# Altium project PS2Transiever.PrjPcb
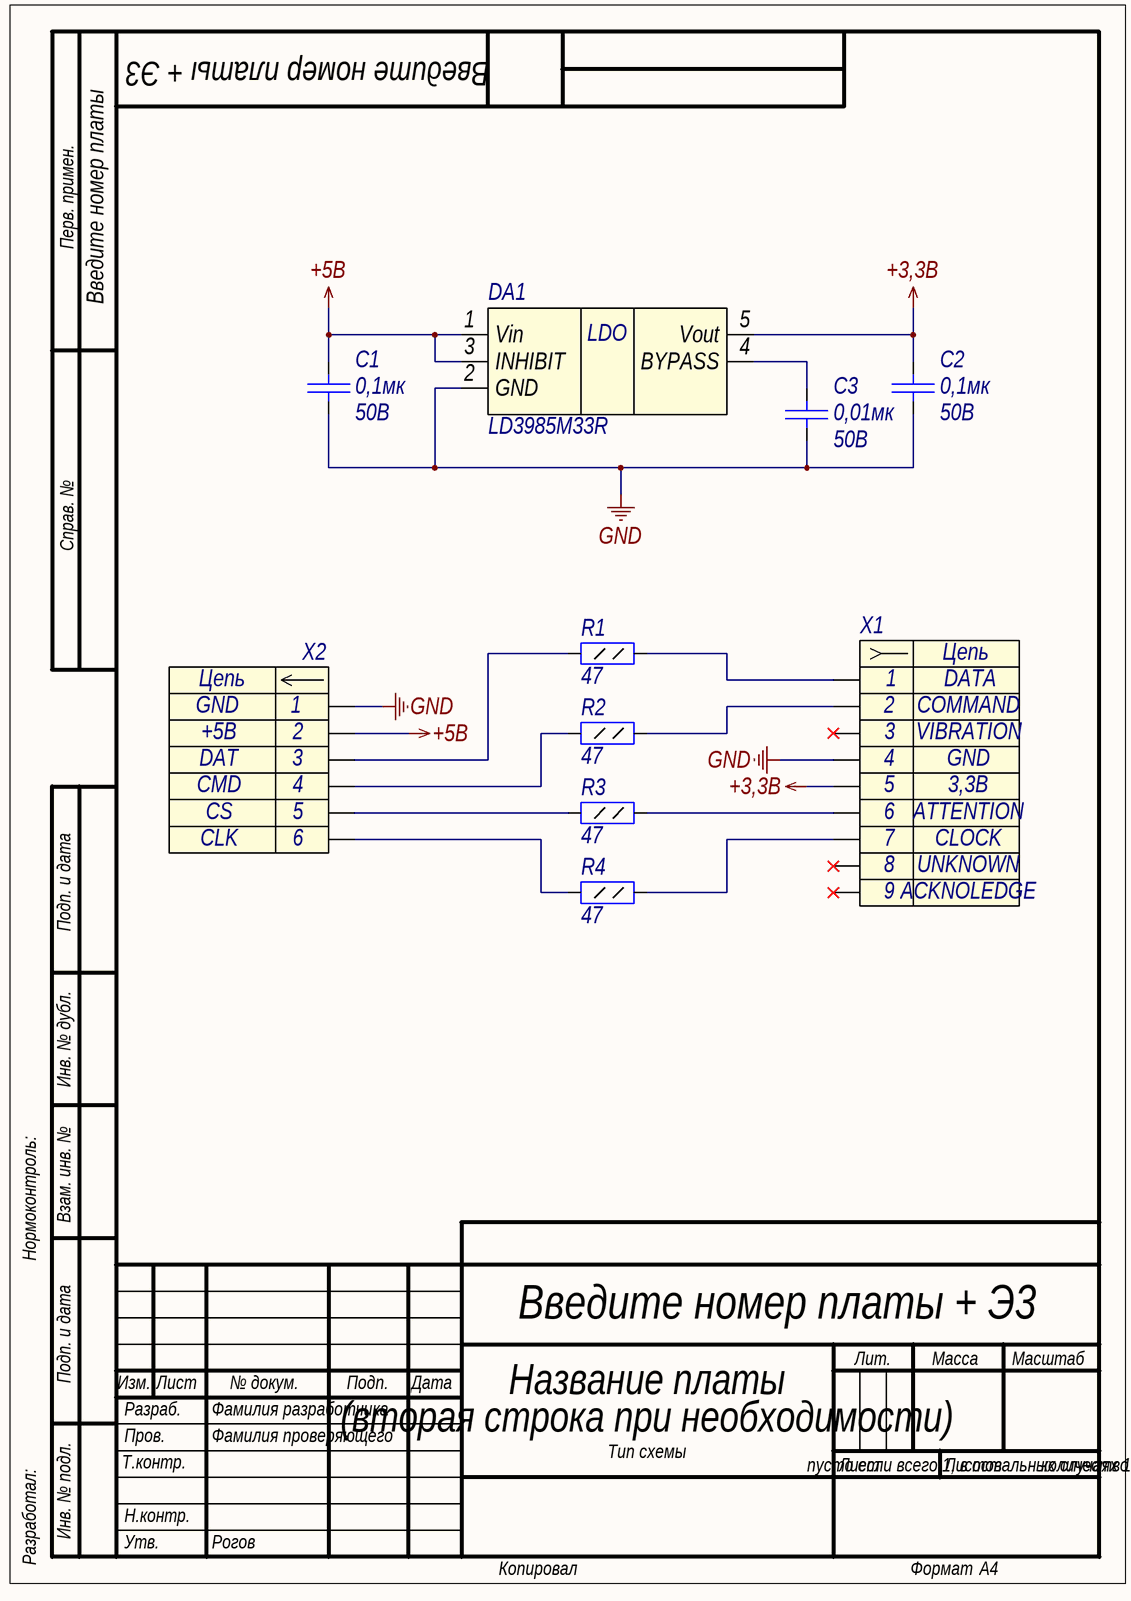
[diagram p0: PS2Transiever.SchDoc]
1 sheet, 10 parts. Net scope: global (net labels, ports and power ports of the same name join across sheets).
Board file: PS2Transiever.PcbDoc

## Sheet PS2Transiever.SchDoc: Название платы
size 209 x 297 mm; ApprovedBy: Рогов; CheckedBy: Фамилия проверяющего; DrawnBy: Фамилия разработчика; DocumentNumber: Введите номер платы + Э3; SheetNumber: пусто если всего 1, в остальных случаях 1; SheetTotal: количество листов; PageSetup: Record=PageOptions|CenterHorizontal=True|CenterVertical=True|PrintScale=0.94|XCorrection=1.00|YCorrection=1.00|PrintKind=2|BorderSize=5000000|LeftOffset=0|BottomOffset=0|Orientation=1|PaperLength=2970|PaperWidth=2100|Scale=100|PaperSource=7|PrintQuality=600|MediaType=1|DitherType=10|PaperKind=A4|PrintScaleMode=1; Title1str: (вторая строка при необходимости); DocumentType: Тип схемы; Format: A4; ImagePath: Введите номер платы

### Parts
C1  Voltage: 50В  [C0805]  (hidden comment: 0,1мк)
C2  Voltage: 50В  [C0805]  (hidden comment: 0,1мк)
C3  Voltage: 50B  [C0805]  (hidden comment: 0,01мк)
DA1  Part Number: LD3985M33R  [SOT23-5]  (hidden comment: LD3985)
R1  value 47  [R0805]  (hidden comment: Resistor_0,125Вт)
R2  value 47  [R0805]  (hidden comment: Resistor_0,125Вт)
R3  value 47  [R0805]  (hidden comment: Resistor_0,125Вт)
R4  value 47  [R0805]  (hidden comment: Resistor_0,125Вт)
X1  Header_9_sct  [PS2-9PIN HEADER]  (value not drawn)
X2  Header_6_plg  [PLS-6]  (value not drawn)

### Nets
+3,3B: C2.2 DA1.5(Vout) X1.5
+5B: C1.2 DA1.1(Vin) DA1.3(INHIBIT) X2.2
GND: C1.1 C2.1 C3.1 DA1.2(GND) X1.4 X2.1
NetC3_2: C3.2 DA1.4(BYPASS)
NetR1_1: R1.1 X1.1
NetR1_2: R1.2 X2.3
NetR2_1: R2.1 X1.2
NetR2_2: R2.2 X2.4
NetR3_1: R3.1 X1.6
NetR3_2: R3.2 X2.5
NetR4_1: R4.1 X1.7
NetR4_2: R4.2 X2.6

Not connected (* = marked no-connect by the designer): X1 3* 8* 9*

### Notes on the sheet
- Перв. примен.
- Справ. №
- Подп. и дата
- Инв. № дубл.
- Нормоконтроль:
- Взам. инв. №
- Изм.
- Лист
- № докум.
- Подп.
- Дата
- Лит.
- Масса
- Масштаб
- Т.контр.
- Пров.
- Разраб.
- Листов
- Разработал:
- Инв. № подл.
- Н.контр.
- Утв.
- Копировал
- Формат
- (in symbol connect5) Цепь
- (in symbol connect132) Цепь
- (in symbol pwr139) LDO

### Library data of the parts
C1 C2 = cap160: Конденсатор; Part Name: Ceramic; Manufacture: Murata; Part Number: GRM21BR71H104KA01L; id: cap160; TKE: X7R; Value: 0,1мк
C3 = cap136: Конденсатор; Part Name: Ceramic; Manufacture: Murata; Part Number: GRM216R71H103K; id: cap136; TKE: X7R; Value: 0,01мк
DA1 = pwr139: Ultra low drop and low noise BiCMOS voltage regulators; Manufacturer: ST Microelectronics; id: pwr139; Input Voltage: 2,5-6В; Output Voltage: 3,3В; Dropout Voltage: 60mB; Current: 150mA; Part Name: Ultra low drop and low noise BiCMOS voltage regulators; Type: Linear
R1-R4 = res41: Резистор; Manufacture: Yageo; Part Number: RC0805FR-0747RL; id: res41; Accuracy: 0,01; Part Name: Resistor; Power: 0,125Вт
X1 = connect132: Разъем - 9 конт. розетка; Part Name: Play Station Header 9 pin; Manufacture: Play Station; Contact_1: DATA; Contact_2: COMMAND; Contact_3: VIBRATION; Contact_4: GND; Contact_5: 3,3B; Contact_6: ATTENTION; Etch: 4mm; Contact_7: CLOCK; Contact_8: UNKNOWN; Contact_9: ACKNOLEDGE; id: connect132
X2 = connect5: Разъем - 6 конт. вилка; Part Number: DS1021-1*6SF112-B; Manufacture: Ningbo connfly electronic; Contact_1: GND; Contact_2: +5B; Contact_3: DAT; Contact_4: CMD; Contact_5: CS; Contact_6: CLK; Etch: 2,54mm; Part Name: PLS-6; id: connect5